# Altium schematic sheet sch3.SchDoc
size 420 x 297 mm; Address1: Address1; Address2: Address2; Address3: Address3; Address4: Address4; DocumentNumber: АБВГ.123456.001 Э3; SheetNumber: 1; Scale: 1:1; DocumentType: Схема электрическая принципиальная; FirstReferrence: АБВГ.123456.001
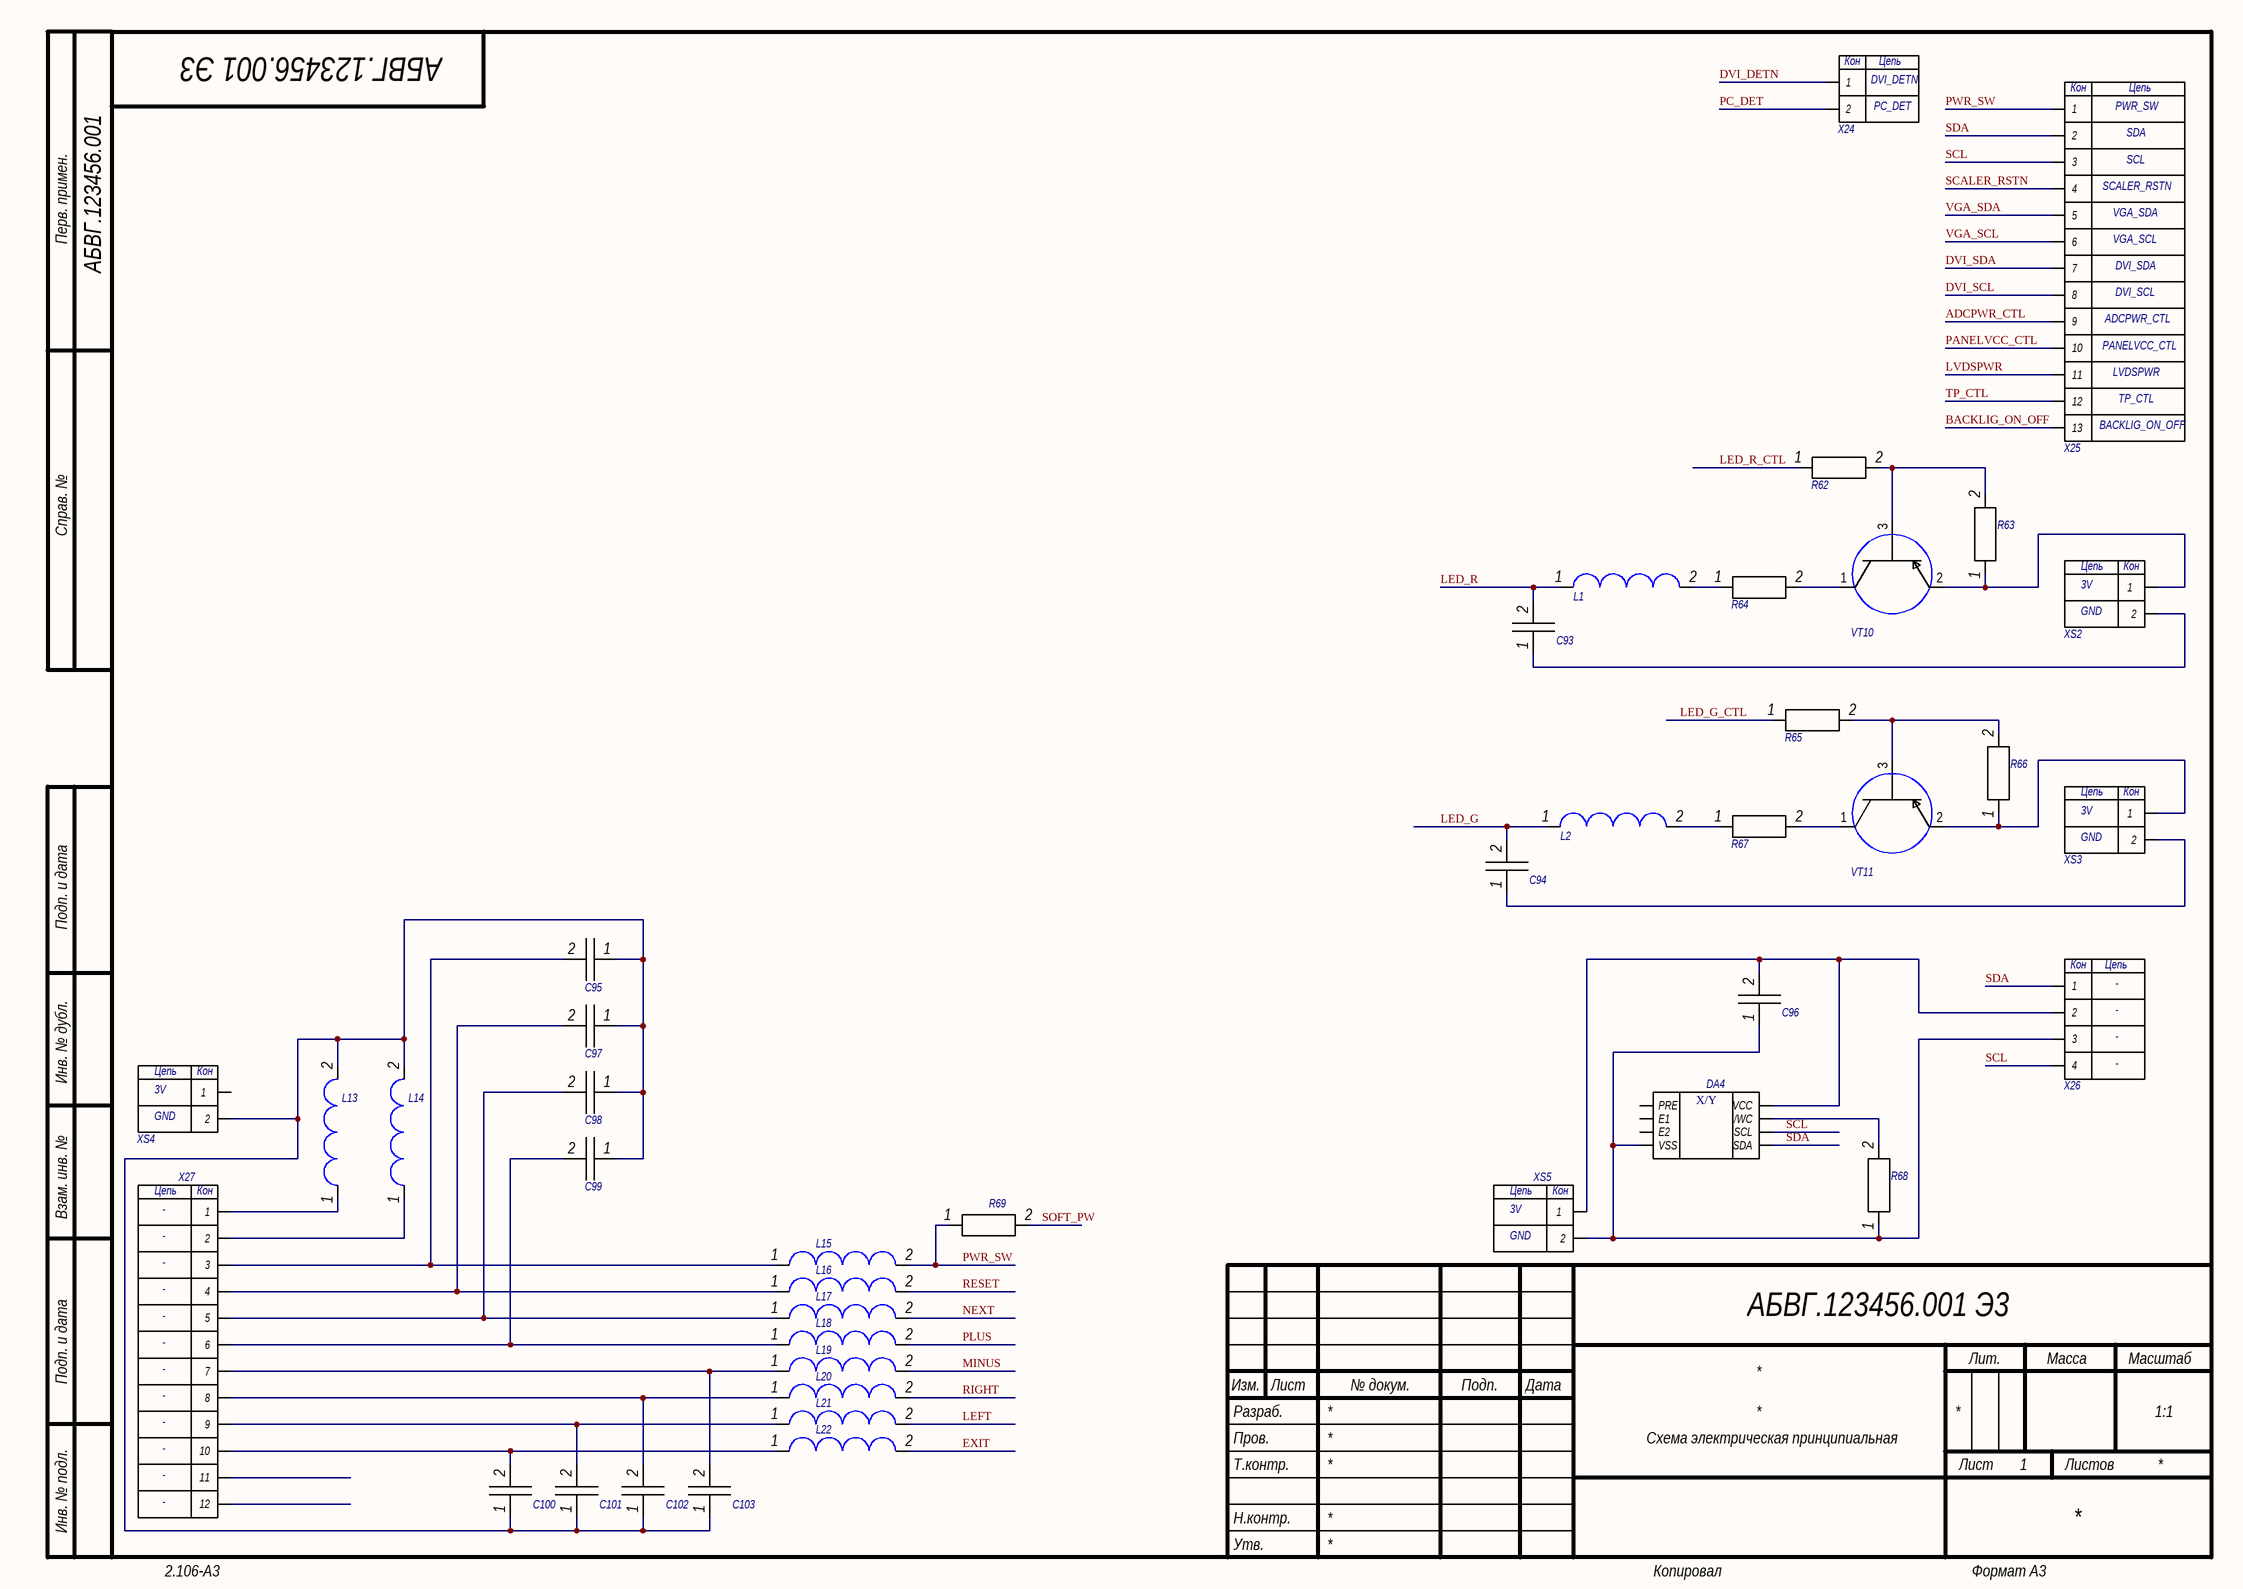
[diagram p0: sch3.SchDoc]

## Parts
C93  *  [Capacitor 0805]  (value not drawn)
C94  *  [Capacitor 0805]  (value not drawn)
C95  *  [Capacitor 0805]  (value not drawn)
C96  *  [Capacitor 0805]  (value not drawn)
C97  *  [Capacitor 0805]  (value not drawn)
C98  *  [Capacitor 0805]  (value not drawn)
C99  *  [Capacitor 0805]  (value not drawn)
C100  *  [Capacitor 0805]  (value not drawn)
C101  *  [Capacitor 0805]  (value not drawn)
C102  *  [Capacitor 0805]  (value not drawn)
C103  *  [Capacitor 0805]  (value not drawn)
DA4  *  [IC102]  (value not drawn)
L1  *  [Inductor 2520]  (value not drawn)
L2  *  [Inductor 2520]  (value not drawn)
L13  *  [Inductor 2520]  (value not drawn)
L14  *  [Inductor 2520]  (value not drawn)
L15  *  [Inductor 2520]  (value not drawn)
L16  *  [Inductor 2520]  (value not drawn)
L17  *  [Inductor 2520]  (value not drawn)
L18  *  [Inductor 2520]  (value not drawn)
L19  *  [Inductor 2520]  (value not drawn)
L20  *  [Inductor 2520]  (value not drawn)
L21  *  [Inductor 2520]  (value not drawn)
L22  *  [Inductor 2520]  (value not drawn)
R62  *  [Resistor 1206]  (value not drawn)
R63  *  [Resistor 1206]  (value not drawn)
R64  *  [Resistor 1206]  (value not drawn)
R65  *  [Resistor 1206]  (value not drawn)
R66  *  [Resistor 1206]  (value not drawn)
R67  *  [Resistor 1206]  (value not drawn)
R68  *  [Resistor 1206]  (value not drawn)
R69  *  [Resistor 1206]  (value not drawn)
VT10  *  [Transistor 1]  (value not drawn)
VT11  *  [Transistor 1]  (value not drawn)
X24  *  [Inputs]  (value not drawn)
X25  *  [Outputs]  (value not drawn)
X26  *  [J102]  (value not drawn)
X27  *  [J101]  (value not drawn)
XS2  *  [VCC-GND]  (value not drawn)
XS3  *  [VCC-GND]  (value not drawn)
XS4  *  [VCC-GND]  (value not drawn)
XS5  *  [VCC-GND]  (value not drawn)

## Nets
ADCPWR_CTL: X25.9
BACKLIG_ON_OFF: X25.13
DVI_DETN: X24.1
DVI_SCL: X25.8
DVI_SDA: X25.7
EXIT: L22.2
LED_G: C94.2 L2.1
LED_G_CTL: R65.1
LED_R: C93.2 L1.1
LED_R_CTL: R62.1
LEFT: L21.2
LVDSPWR: X25.11
MINUS: L19.2
NEXT: L17.2
PANELVCC_CTL: X25.10
PC_DET: X24.2
PLUS: L18.2
PWR_SW: L15.2 R69.1 X25.1
RESET: L16.2
RIGHT: L20.2
SCALER_RSTN: X25.4
SCL: DA4.7(SCL) X25.3 X26.4
SDA: DA4.8(SDA) X25.2 X26.1
SOFT_PW: R69.2
TP_CTL: X25.12
VGA_SCL: X25.6
VGA_SDA: X25.5
NetC93_1: C93.1 XS2.2
NetC94_1: C94.1 XS3.2
NetC95_1: C95.1 C97.1 C98.1 C99.1 C100.1 C101.1 C102.1 C103.1 L13.2 L14.2 XS4.2
NetC95_2: C95.2 L15.1 X27.3
NetC96_1: C96.1 DA4.4(VSS) R68.1 X26.3 XS5.2
NetC96_2: C96.2 DA4.5(VCC) X26.2 XS5.1
NetC97_2: C97.2 L16.1 X27.4
NetC98_2: C98.2 L17.1 X27.5
NetC99_2: C99.2 L18.1 X27.6
NetC100_2: C100.2 L22.1 X27.10
NetC101_2: C101.2 L21.1 X27.9
NetC102_2: C102.2 L20.1 X27.8
NetC103_2: C103.2 L19.1 X27.7
NetDA4_6: DA4.6(/WC) R68.2
NetL1_2: L1.2 R64.1
NetL2_2: L2.2 R67.1
NetL13_1: L13.1 X27.1
NetL14_1: L14.1 X27.2
NetR62_2: R62.2 R63.2 VT10.3(BAZA)
NetR63_1: R63.1 VT10.2(EMITTER) XS2.1
NetR64_2: R64.2 VT10.1(KOLLECTOR)
NetR65_2: R65.2 R66.2 VT11.3(BAZA)
NetR66_1: R66.1 VT11.2(EMITTER) XS3.1
NetR67_2: R67.2 VT11.1(KOLLECTOR)

Not connected (* = marked no-connect by the designer): DA4 1(PRE) 2(E1) 3(E2); X27 11 12; XS4 1

## Notes on the sheet
- Перв. примен.
- Справ. №
- Подп. и дата
- Инв. № дубл.
- Взам. инв. №
- Разраб.
- Изм.
- Лист
- № докум.
- Подп.
- Дата
- Лит.
- Масса
- Масштаб
- Пров.
- Т.контр.
- Листов
- Инв. № подл.
- Утв.
- Н.контр.
- 2.106-A3
- Копировал
- Формат А3
- (in symbol IC102) X/Y
- (in symbol Inputs) Кон; Цепь; DVI_DETN; PC_DET
- (in symbol J101) Цепь; Кон; -
- (in symbol J102) Кон; Цепь; -
- (in symbol Outputs) Кон; Цепь; PWR_SW; SDA; SCL; SCALER_RSTN; VGA_SDA; VGA_SCL; DVI_SDA; DVI_SCL; ADCPWR_CTL; PANELVCC_CTL; LVDSPWR; TP_CTL; BACKLIG_ON_OFF
- (in symbol VCC-GND R) Цепь; Кон; 3V; GND

## Library data of the parts
C93-C103 = Capacitor: Model: *
DA4 = IC102
L1 L2 L13-L22 = Inductor: Model: *
R62-R69 = Resistor: Model: *
VT10 VT11 = Transistor 2
X24 = Inputs
X25 = Outputs
X26 = J102
X27 = J101
XS2-XS5 = VCC-GND R